# EasyEDA schematic SCH_lic-555_2025-01-28.json
TITLE: Sheet_1; REV: 1.0; Date: 2024-03-01; Sheet: 1/1; Drawn By: neethujaisan2025; Company: Your Company
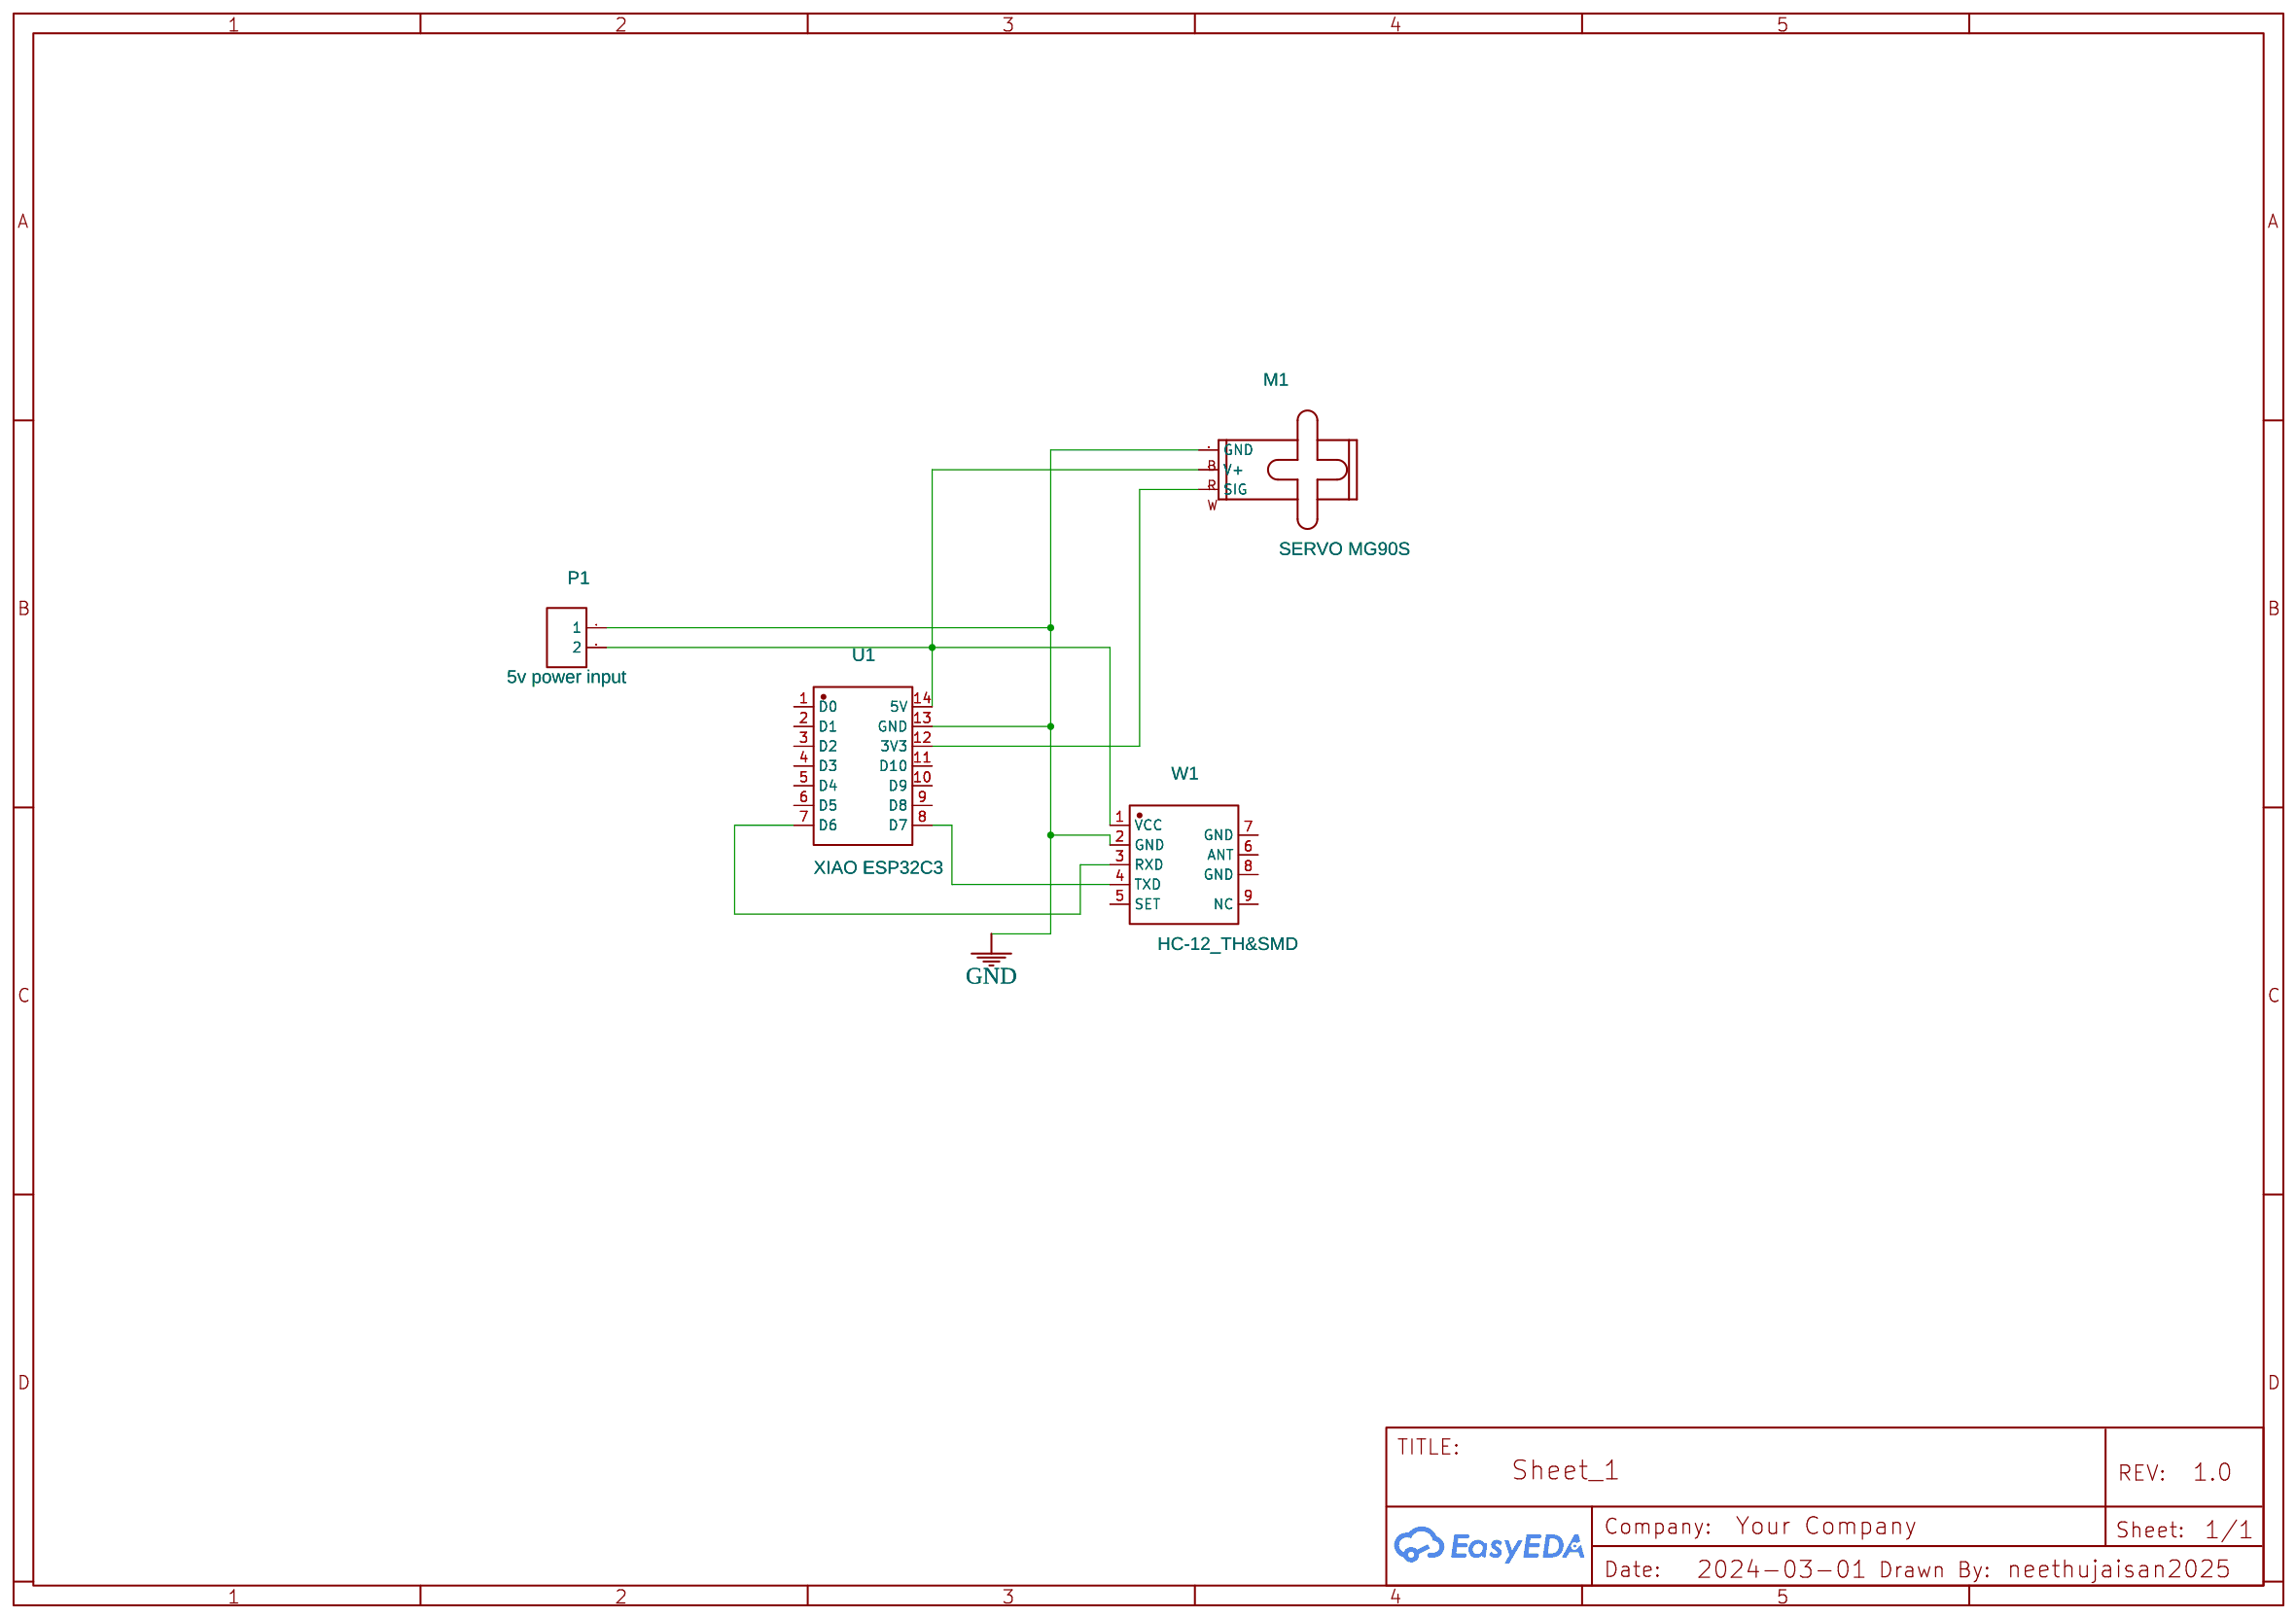
[diagram p0: schematic sheet]

## Parts
M1  SERVO MG90S  [1X03]
P1  5v power input  [HDR-F-2.54_1X2]
U1  XIAO ESP32C3  [COMM-SMD_KQ-2801_V106]
W1  HC-12_TH&SMD  [COMM-SMD_HC-12]

## Library data of the parts
M1 = SMALL_SERVO: Small servo motor; Contributor: SparkFun
P1 = HDR-F-2.54_1x2: Supplier Part: C49661; Supplier: LCSC; Contributor: LCEDA_Lib
U1 = XIAO ESP32C3: Supplier: LCSC; Supplier Part: C19189385; Manufacturer: null; JLCPCB Part Class: Extended Part; Contributor: lcsc
W1 = HC-12_TH&SMD: Supplier: LCSC; Supplier Part: C9900113373; Manufacturer: null; Contributor: lcsc

## Nets
GND: M1.3(GND) P1.1 U1.13(GND) W1.2(GND)
Net-(M1-1): M1.1(SIG) U1.12(3V3)
Net-(M1-2): M1.2(V+) P1.2 U1.14(5V) W1.1(VCC)
Net-(U1-7): U1.7(D6) W1.3(RXD)
Net-(U1-8): U1.8(D7) W1.4(TXD)

Not connected (* = marked no-connect by the designer): U1 1(D0) 2(D1) 3(D2) 4(D3) 5(D4) 6(D5) 9(D8) 10(D9) 11(D10); W1 5(SET) 6(ANT) 7(GND) 8(GND) 9(NC)
